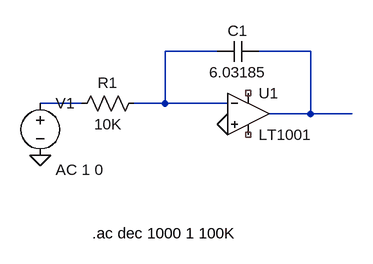
[diagram p0: schematic Draft5.asc]
Draft5.asc, the LTspice schematic file:
Version 4
SHEET 1 880 1032
WIRE 32 736 -48 736
WIRE 176 736 96 736
WIRE -176 816 -240 816
WIRE -48 816 -48 736
WIRE -48 816 -96 816
WIRE 48 816 -48 816
WIRE 176 832 176 736
WIRE 176 832 112 832
WIRE 240 832 176 832
FLAG -240 896 0
FLAG 48 848 0
SYMBOL OpAmps/LT1001 80 768 R0
SYMATTR InstName U1
SYMBOL Voltage -240 800 R0
WINDOW 3 24 96 Invisible 2
WINDOW 123 24 118 Left 2
SYMATTR InstName V1
SYMATTR Value ""
SYMATTR Value2 AC 1 0
SYMBOL Res -80 800 R90
WINDOW 0 0 56 VBottom 2
WINDOW 3 32 56 VTop 2
SYMATTR InstName R1
SYMATTR Value 10K
SYMBOL Cap 96 720 R90
WINDOW 0 0 32 VBottom 2
WINDOW 3 32 32 VTop 2
SYMATTR InstName C1
SYMATTR Value 6.03185
TEXT -160 1016 Left 2 !.ac dec 1000 1 100K

The netlist it stands for:
* Draft5.asc
XU1 0 N001 NC_01 NC_02 N002 LT1001  ; pins In+ In- V+ V- OUT
V1 N003 0 AC 1 0
R1 N001 N003 10K
C1 N002 N001 6.03185
.ac dec 1000 1 100K
.lib LTC.lib
.backanno
.end